# Altium schematic sheet usb sheet.SchDoc
size A; SheetNumber: 2; SheetTotal: 3
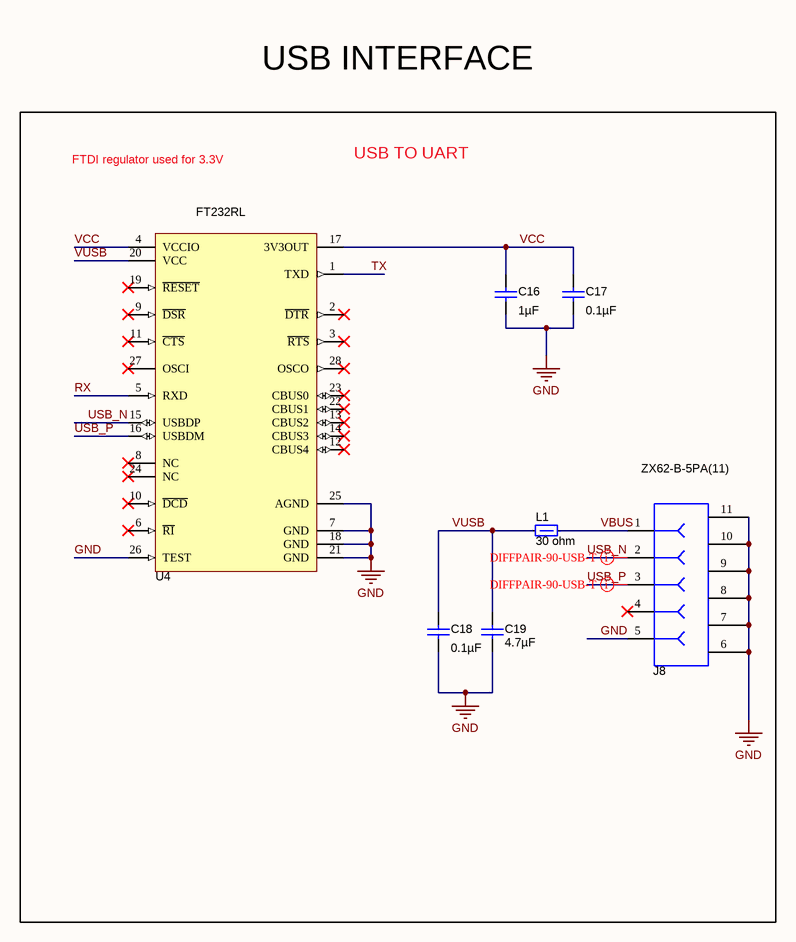
[diagram p0: usb sheet.SchDoc]

## Parts
C16  ValueDisplayed: 1µF  [0402L]  (hidden comment: GRM155R61A105KE15D)
C17  ValueDisplayed: 0.1µF  [0402L]  (hidden comment: GRM155R61A104KA01D)
C18  ValueDisplayed: 0.1µF  [0402L]  (hidden comment: GRM155R61A104KA01D)
C19  ValueDisplayed: 4.7µF  [0603L]  (hidden comment: CGB3B1X5R1A475K055AC)
J8  ZX62-B-5PA(11)  [CONN_USB_micro_ZX62-B-5PA]
L1  value 30 ohm  [0805L]  (hidden comment: MMZ2012R300A)
U4  FT232RL  [SSOP28_M]

## Nets
GND: C16.2 C17.2 C18.2 C19.2 J8.5 J8.6 J8.7 J8.8 J8.9 J8.10 J8.11 U4.7(GND) U4.18(GND) U4.21(GND) U4.25(AGND) U4.26(TEST)
RX: U4.5(RXD)
TX: U4.1(TXD)
USB_N: J8.2 U4.15(USBDP)
USB_P: J8.3 U4.16(USBDM)
VBUS: J8.1 L1.2
VCC: C16.1 C17.1 U4.4(VCCIO) U4.17(3V3OUT)
VUSB: C18.1 C19.1 L1.1 U4.20(VCC)

Not connected (* = marked no-connect by the designer): J8 4*; U4 2(~{DTR})* 3(~{RTS})* 6(~{RI})* 8(NC)* 9(~{DSR})* 10(~{DCD})* 11(~{CTS})* 12(CBUS4)* 13(CBUS2)* 14(CBUS3)* 19(~{RESET})* 22(CBUS1)* 23(CBUS0)* 24(NC)* 27(OSCI)* 28(OSCO)*

## Layout directives
differential pair; differential pair class DIFFPAIR-90-USB: USB_N, USB_P

## Notes on the sheet
- USB INTERFACE
- USB TO UART
- FTDI regulator used for 3.3V

## Library data of the parts
C16 = GRM155R61A105KE15D: CAP, CERM, 1 µF, 10 V, +/- 10%, X5R, 0402; Manufacturer: MuRata; Value: 1uF; Polarized: N; CompType: Capacitor; U/M: EA; Cap_F: 0.000001; Tolerance_%: 10; Value1: Unknown; Value2: 10V; TaMin_C: -55; TaMax_C: 85; Cap_Case: 0402; SymbolVersion: 2008-07-09; PartNumber: GRM155R61A105KE15D; PackageReference: 0402; RoHS: Y; VDC_V: 10; MountType: SMT; Technology: Ceramic; TempCo: X5R; Published: 2008-06-19; Publisher: Texas Instruments; LatestRevisionDate: 2015-06-10; ComponentLink1Description: Datasheet link; ComponentLink1URL: http://search.murata.co.jp/Ceramy/PnsearchViewAction.do?HnOFG=ON&HnNFG=ON&SEL_CNT=50&sLang=en&sKey=GRM155R61A105KE15D&x=9&y=9&search=startwith; Supplier 1: Digi-Key; Supplier Part Number 1: 490-3890-1-ND; Supplier 2: Mouser; Supplier Part Number 2: 81-GRM155R61A105KE15; Supplier 3: Farnell; Supplier Part Number 3: 1735523
C17 C18 = GRM155R61A104KA01D: CAP, CERM, 0.1 µF, 10 V, +/- 10%, X5R, 0402; Manufacturer: MuRata; Value: 0.1uF; Polarized: N; CompType: Capacitor; U/M: EA; Cap_F: 0.0000001; Tolerance_%: 10; Value1: Unknown; Value2: 10V; TaMin_C: -55; TaMax_C: 85; Cap_Case: 0402; SymbolVersion: 2008-07-09; PartNumber: GRM155R61A104KA01D; PackageReference: 0402; RoHS: Y; VDC_V: 10; MountType: SMT; Technology: Ceramic; TempCo: X5R; Published: 2008-06-19; Publisher: Texas Instruments; LatestRevisionDate: 2015-06-10; ComponentLink1Description: Datasheet link; ComponentLink1URL: http://search.murata.co.jp/Ceramy/PnsearchViewAction.do?HnOFG=ON&HnNFG=ON&SEL_CNT=50&sLang=en&sKey=GRM155R61A104KA01D&x=9&y=9&search=startwith; Supplier 1: Digi-Key; Supplier Part Number 1: 490-1318-1-ND; Supplier 2: Mouser; Supplier Part Number 2: 81-GRM155R61A104KA01; Supplier 3: Farnell; Supplier Part Number 3: 1828862
C19 = CGB3B1X5R1A475K055AC: CAP, CERM, 4.7 µF, 10 V, +/- 10%, X5R, 0603; Manufacturer: TDK; Polarized: N; CompType: Capacitor; Value: 4.7uF; U/M: EA; Cap_F: 0.0000047; Tolerance_%: 10; Value1: Unknown; Value2: 10V; TaMin_C: -55; TaMax_C: 85; Cap_Case: 0603; SymbolVersion: 2008-07-09; PartNumber: CGB3B1X5R1A475K055AC; PackageReference: 0603; RoHS: Y; VDC_V: 10; MountType: SMT; Technology: Ceramic; TempCo: X5R; Published: 2008-06-19; Publisher: Texas Instruments; LatestRevisionDate: 2015-06-10; ComponentLink1Description: Datasheet link; ComponentLink1URL: http://www.tdk.com/pdf/mlcc_product_guide_A12.pdf; Supplier 1: Digi-Key; Supplier Part Number 1: 445-7482-1-ND
J8 = ZX62-B-5PA(11): Connector, Receptacle, Micro-USB Type B, R/A, Bottom Mount SMT; Manufacturer: Hirose Electric Co. Ltd.; SymbolCreator: a0411947; U/M: EA; SymbolVersion: 2013-04-05; PartNumber: ZX62-B-5PA(11); PackageReference: Micro USB-B receptacle; CompType: Receptacle; RoHS: Y; MountType: SMT; ComponentLink1Description: Datasheet Link; ComponentLink1URL: http://www.hirose.co.jp/cataloge_hp/e24200011.pdf; Publisher: Texas Instruments; LatestRevisionDate: 2015-06-10; Supplier 1: Digi-Key; Supplier Part Number 1: H11634CT-ND; Supplier 2: Mouser; Supplier Part Number 2: 798-ZX62-B-5PA11; Supplier 3: Farnell; Supplier Part Number 3: 1645325
L1 = MMZ2012R300A_2: Ferrite Bead, 30 ohm @ 100 MHz, 1.5 A, 0805; Manufacturer: TDK; Imax_A: 1.5; DCR_ohm: 0.05; Value1: 0.05 ohm; Value2: 1.5A; ZTyp@100MHz_Ohm: 30; ComponentLink1URL: http://www.tdk.co.jp/tefe02/e9412_mmz.pdf; PackageReference: 0805; SymbolVersion: 2009-06-02; PartNumber: MMZ2012R300A; ComponentLink1Description: Datasheet link; Supplier 1: Digi-Key; Supplier Part Number 1: 445-2199-1-ND; MountType: SMT; CompType: Ferrite Bead; Published: 2014-04-30; Publisher: Texas Instruments; LatestRevisionDate: 2015-06-08; RoHS: Y; Supplier 2: Mouser; Supplier Part Number 2: 810-MMZ2012R300A; Supplier 3: Farnell; Supplier Part Number 3: 1669723
U4 = FT232RL: USB to Serial UART, SSOP28; Manufacturer: FTDI; SymbolCreator: x0208326; ComponentLink1URL: http://www.ftdichip.com/Support/Documents/DataSheets/ICs/DS_FT232R.pdf; PackageReference: SSOP28; PartNumber: FT232RL; SymbolVersion: 2014-03-03; ComponentLink1Description: Datasheet Link; Supplier 1: Digi-Key; Supplier Part Number 1: 768-1007-1-ND; MountType: SMT; RoHS: Y; Publisher: Texas Instruments; LatestRevisionDate: 2015-06-10; Supplier 2: Mouser; Supplier Part Number 2: 895-FT232RL; Supplier 3: Farnell; Supplier Part Number 3: 1146032